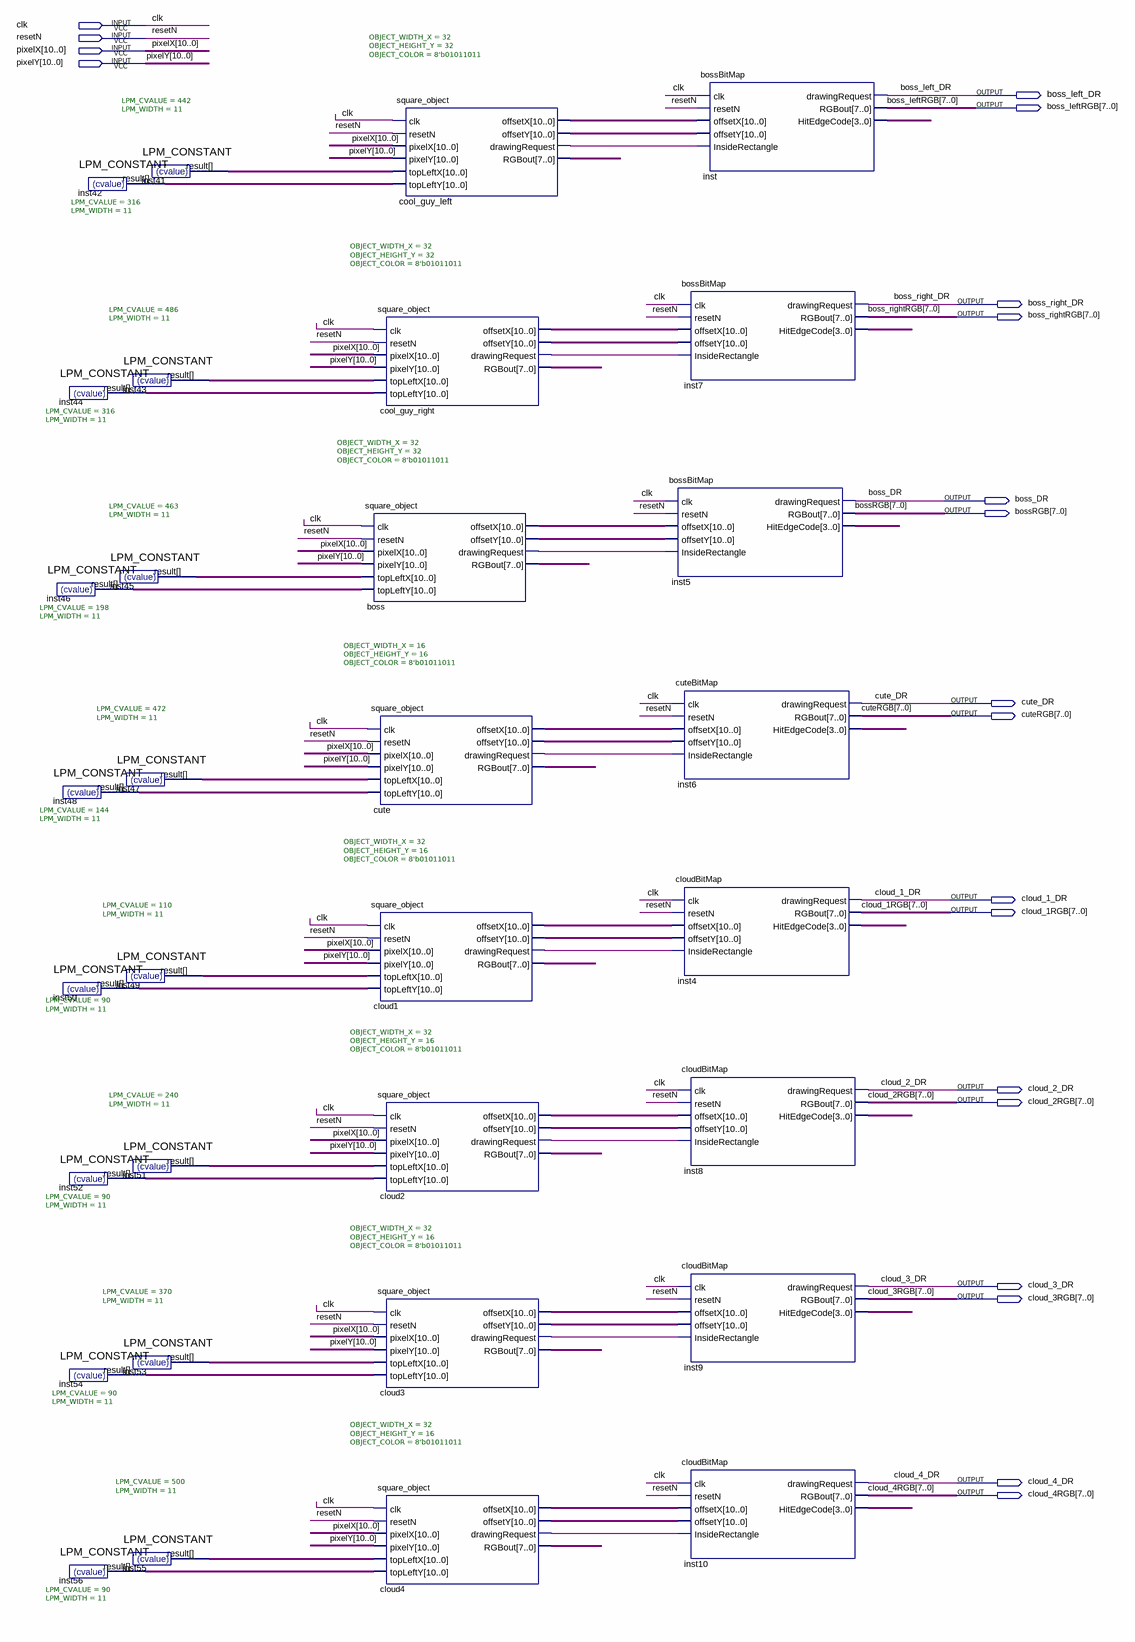
[diagram p0: schematic sheet]
// Quartus schematic baddies_in_bg_block.bdf as structural Verilog: 32 symbols, 20 pins
module baddies_in_bg_block (
  input  clk,
  input  resetN,
  input  [10:0] pixelX,
  input  [10:0] pixelY,
  output boss_left_DR,
  output [7:0] boss_leftRGB,
  output boss_right_DR,
  output [7:0] boss_rightRGB,
  output boss_DR,
  output [7:0] bossRGB,
  output cute_DR,
  output [7:0] cuteRGB,
  output cloud_1_DR,
  output [7:0] cloud_1RGB,
  output cloud_2_DR,
  output [7:0] cloud_2RGB,
  output cloud_3_DR,
  output [7:0] cloud_3RGB,
  output cloud_4_DR,
  output [7:0] cloud_4RGB
);

  wire boss_drawingrequest, cloud1_drawingrequest, cloud2_drawingrequest, cloud3_drawingrequest,
       cloud4_drawingrequest, cool_guy_left_drawingrequest, cool_guy_right_drawingrequest,
       cute_drawingrequest;
  wire [3:0] inst4_hitedgecode, inst5_hitedgecode, inst6_hitedgecode, inst7_hitedgecode, inst8_hitedgecode,
       inst9_hitedgecode, inst10_hitedgecode, inst_hitedgecode;
  wire [7:0] boss_rgbout, cloud1_rgbout, cloud2_rgbout, cloud3_rgbout, cloud4_rgbout, cool_guy_left_rgbout,
       cool_guy_right_rgbout, cute_rgbout;
  wire [10:0] boss_offsetx, boss_offsety, cloud1_offsetx, cloud1_offsety, cloud2_offsetx, cloud2_offsety,
       cloud3_offsetx, cloud3_offsety, cloud4_offsetx, cloud4_offsety, cool_guy_left_offsetx,
       cool_guy_left_offsety, cool_guy_right_offsetx, cool_guy_right_offsety, cute_offsetx, cute_offsety,
       inst41_result, inst42_result, inst43_result, inst44_result, inst45_result, inst46_result,
       inst47_result, inst48_result, inst49_result, inst50_result, inst51_result, inst52_result,
       inst53_result, inst54_result, inst55_result, inst56_result;

  LPM_CONSTANT #(.LPM_CVALUE(316), .LPM_WIDTH(11)) inst42 (.result(inst42_result));
  LPM_CONSTANT #(.LPM_CVALUE(316), .LPM_WIDTH(11)) inst44 (.result(inst44_result));
  LPM_CONSTANT #(.LPM_CVALUE(198), .LPM_WIDTH(11)) inst46 (.result(inst46_result));
  LPM_CONSTANT #(.LPM_CVALUE(144), .LPM_WIDTH(11)) inst48 (.result(inst48_result));
  LPM_CONSTANT #(.LPM_CVALUE(90), .LPM_WIDTH(11)) inst50 (.result(inst50_result));
  LPM_CONSTANT #(.LPM_CVALUE(90), .LPM_WIDTH(11)) inst52 (.result(inst52_result));
  LPM_CONSTANT #(.LPM_CVALUE(90), .LPM_WIDTH(11)) inst54 (.result(inst54_result));
  LPM_CONSTANT #(.LPM_CVALUE(90), .LPM_WIDTH(11)) inst56 (.result(inst56_result));
  LPM_CONSTANT #(.LPM_CVALUE(442), .LPM_WIDTH(11)) inst41 (.result(inst41_result));
  LPM_CONSTANT #(.LPM_CVALUE(486), .LPM_WIDTH(11)) inst43 (.result(inst43_result));
  LPM_CONSTANT #(.LPM_CVALUE(463), .LPM_WIDTH(11)) inst45 (.result(inst45_result));
  LPM_CONSTANT #(.LPM_CVALUE(472), .LPM_WIDTH(11)) inst47 (.result(inst47_result));
  LPM_CONSTANT #(.LPM_CVALUE(110), .LPM_WIDTH(11)) inst49 (.result(inst49_result));
  LPM_CONSTANT #(.LPM_CVALUE(240), .LPM_WIDTH(11)) inst51 (.result(inst51_result));
  LPM_CONSTANT #(.LPM_CVALUE(370), .LPM_WIDTH(11)) inst53 (.result(inst53_result));
  LPM_CONSTANT #(.LPM_CVALUE(500), .LPM_WIDTH(11)) inst55 (.result(inst55_result));
  square_object #(.OBJECT_WIDTH_X(32), .OBJECT_HEIGHT_Y(32), .OBJECT_COLOR(8'b01011011)) cool_guy_left (
    .clk(clk), .resetN(resetN), .pixelX(pixelX), .pixelY(pixelY), .topLeftX(inst41_result),
    .topLeftY(inst42_result), .offsetX(cool_guy_left_offsetx), .offsetY(cool_guy_left_offsety),
    .drawingRequest(cool_guy_left_drawingrequest), .RGBout(cool_guy_left_rgbout));
  square_object #(.OBJECT_WIDTH_X(32), .OBJECT_HEIGHT_Y(32), .OBJECT_COLOR(8'b01011011)) cool_guy_right (
    .clk(clk), .resetN(resetN), .pixelX(pixelX), .pixelY(pixelY), .topLeftX(inst43_result),
    .topLeftY(inst44_result), .offsetX(cool_guy_right_offsetx), .offsetY(cool_guy_right_offsety),
    .drawingRequest(cool_guy_right_drawingrequest), .RGBout(cool_guy_right_rgbout));
  square_object #(.OBJECT_WIDTH_X(32), .OBJECT_HEIGHT_Y(32), .OBJECT_COLOR(8'b01011011)) boss (
    .clk(clk), .resetN(resetN), .pixelX(pixelX), .pixelY(pixelY), .topLeftX(inst45_result),
    .topLeftY(inst46_result), .offsetX(boss_offsetx), .offsetY(boss_offsety),
    .drawingRequest(boss_drawingrequest), .RGBout(boss_rgbout));
  square_object #(.OBJECT_WIDTH_X(16), .OBJECT_HEIGHT_Y(16), .OBJECT_COLOR(8'b01011011)) cute (
    .clk(clk), .resetN(resetN), .pixelX(pixelX), .pixelY(pixelY), .topLeftX(inst47_result),
    .topLeftY(inst48_result), .offsetX(cute_offsetx), .offsetY(cute_offsety),
    .drawingRequest(cute_drawingrequest), .RGBout(cute_rgbout));
  square_object #(.OBJECT_WIDTH_X(32), .OBJECT_HEIGHT_Y(16), .OBJECT_COLOR(8'b01011011)) cloud1 (
    .clk(clk), .resetN(resetN), .pixelX(pixelX), .pixelY(pixelY), .topLeftX(inst49_result),
    .topLeftY(inst50_result), .offsetX(cloud1_offsetx), .offsetY(cloud1_offsety),
    .drawingRequest(cloud1_drawingrequest), .RGBout(cloud1_rgbout));
  square_object #(.OBJECT_WIDTH_X(32), .OBJECT_HEIGHT_Y(16), .OBJECT_COLOR(8'b01011011)) cloud2 (
    .clk(clk), .resetN(resetN), .pixelX(pixelX), .pixelY(pixelY), .topLeftX(inst51_result),
    .topLeftY(inst52_result), .offsetX(cloud2_offsetx), .offsetY(cloud2_offsety),
    .drawingRequest(cloud2_drawingrequest), .RGBout(cloud2_rgbout));
  square_object #(.OBJECT_WIDTH_X(32), .OBJECT_HEIGHT_Y(16), .OBJECT_COLOR(8'b01011011)) cloud3 (
    .clk(clk), .resetN(resetN), .pixelX(pixelX), .pixelY(pixelY), .topLeftX(inst53_result),
    .topLeftY(inst54_result), .offsetX(cloud3_offsetx), .offsetY(cloud3_offsety),
    .drawingRequest(cloud3_drawingrequest), .RGBout(cloud3_rgbout));
  square_object #(.OBJECT_WIDTH_X(32), .OBJECT_HEIGHT_Y(16), .OBJECT_COLOR(8'b01011011)) cloud4 (
    .clk(clk), .resetN(resetN), .pixelX(pixelX), .pixelY(pixelY), .topLeftX(inst55_result),
    .topLeftY(inst56_result), .offsetX(cloud4_offsetx), .offsetY(cloud4_offsety),
    .drawingRequest(cloud4_drawingrequest), .RGBout(cloud4_rgbout));
  bossBitMap inst (
    .clk(clk), .resetN(resetN), .offsetX(cool_guy_left_offsetx), .offsetY(cool_guy_left_offsety),
    .InsideRectangle(cool_guy_left_drawingrequest), .drawingRequest(boss_left_DR), .RGBout(boss_leftRGB),
    .HitEdgeCode(inst_hitedgecode));
  bossBitMap inst7 (
    .clk(clk), .resetN(resetN), .offsetX(cool_guy_right_offsetx), .offsetY(cool_guy_right_offsety),
    .InsideRectangle(cool_guy_right_drawingrequest), .drawingRequest(boss_right_DR), .RGBout(boss_rightRGB),
    .HitEdgeCode(inst7_hitedgecode));
  bossBitMap inst5 (
    .clk(clk), .resetN(resetN), .offsetX(boss_offsetx), .offsetY(boss_offsety),
    .InsideRectangle(boss_drawingrequest), .drawingRequest(boss_DR), .RGBout(bossRGB),
    .HitEdgeCode(inst5_hitedgecode));
  cuteBitMap inst6 (
    .clk(clk), .resetN(resetN), .offsetX(cute_offsetx), .offsetY(cute_offsety),
    .InsideRectangle(cute_drawingrequest), .drawingRequest(cute_DR), .RGBout(cuteRGB),
    .HitEdgeCode(inst6_hitedgecode));
  cloudBitMap inst4 (
    .clk(clk), .resetN(resetN), .offsetX(cloud1_offsetx), .offsetY(cloud1_offsety),
    .InsideRectangle(cloud1_drawingrequest), .drawingRequest(cloud_1_DR), .RGBout(cloud_1RGB),
    .HitEdgeCode(inst4_hitedgecode));
  cloudBitMap inst8 (
    .clk(clk), .resetN(resetN), .offsetX(cloud2_offsetx), .offsetY(cloud2_offsety),
    .InsideRectangle(cloud2_drawingrequest), .drawingRequest(cloud_2_DR), .RGBout(cloud_2RGB),
    .HitEdgeCode(inst8_hitedgecode));
  cloudBitMap inst9 (
    .clk(clk), .resetN(resetN), .offsetX(cloud3_offsetx), .offsetY(cloud3_offsety),
    .InsideRectangle(cloud3_drawingrequest), .drawingRequest(cloud_3_DR), .RGBout(cloud_3RGB),
    .HitEdgeCode(inst9_hitedgecode));
  cloudBitMap inst10 (
    .clk(clk), .resetN(resetN), .offsetX(cloud4_offsetx), .offsetY(cloud4_offsety),
    .InsideRectangle(cloud4_drawingrequest), .drawingRequest(cloud_4_DR), .RGBout(cloud_4RGB),
    .HitEdgeCode(inst10_hitedgecode));
endmodule
